# Altium schematic sheet Half_Slave.SchDoc
size B
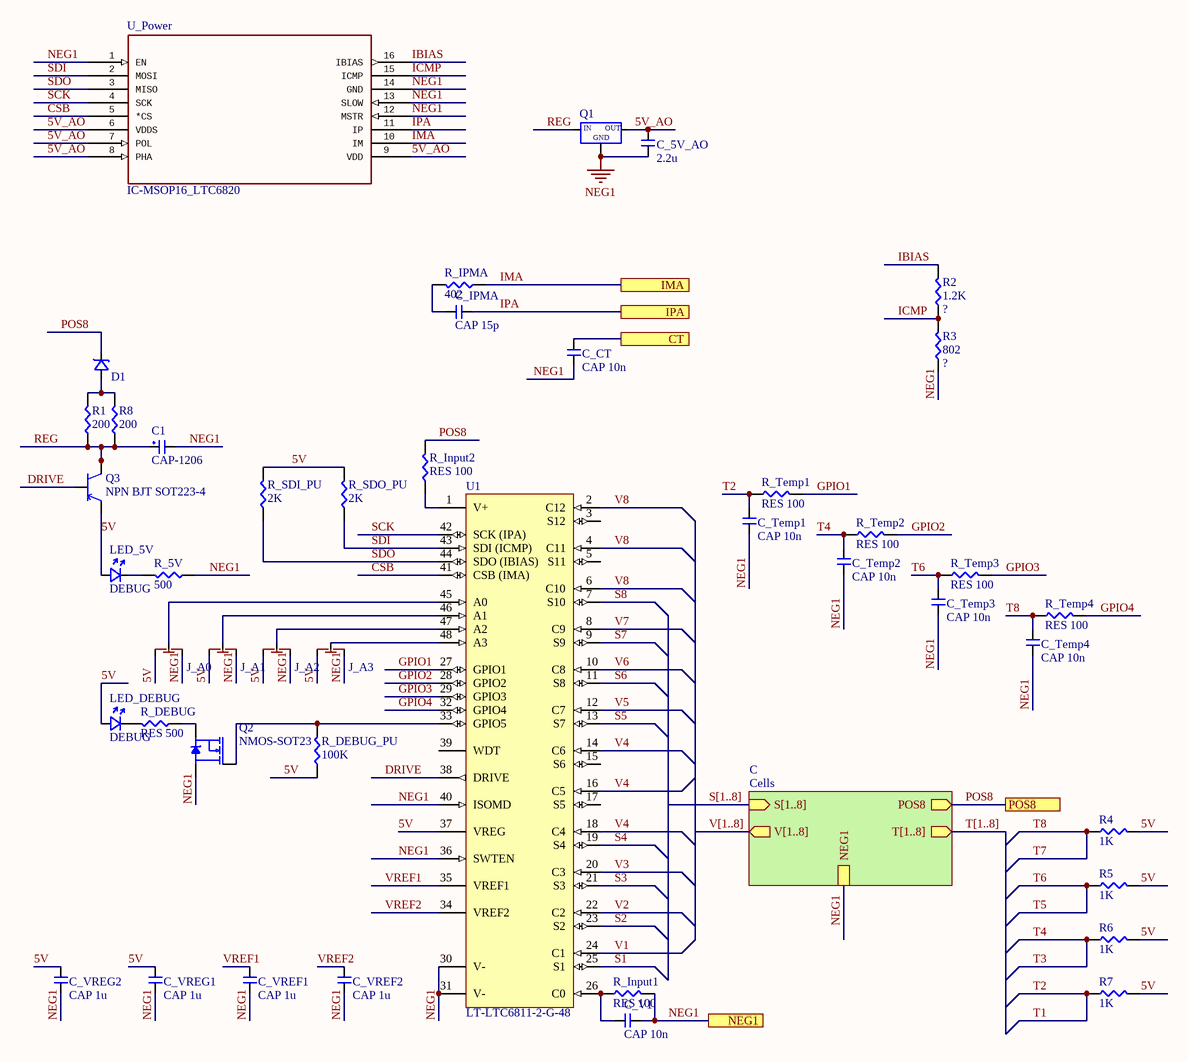
[diagram p0: Half_Slave.SchDoc]

## Parts
C1  CAP-1206  [CAPCP3216X16N]
C_5V_AO  2.2u  [CAP-0603]
C_CT  CAP 10n  [CAP-0603]
C_IPMA  CAP 15p  [CAP-0603]
C_Temp1  CAP 10n  [CAP-0603]
C_Temp2  CAP 10n  [CAP-0603]
C_Temp3  CAP 10n  [CAP-0603]
C_Temp4  CAP 10n  [CAP-0603]
C_V1  CAP 10n  [CAP-0603]
C_VREF1  CAP 1u  [CAP-0603]
C_VREF2  CAP 1u  [CAP-0603]
C_VREG1  CAP 1u  [CAP-0603]
C_VREG2  CAP 1u  [CAP-0603]
D1  ?  [SMB]  (value not drawn)
J_A0  DPDT Solder Jumper  [DPDT Solder]  (value not drawn)
J_A1  DPDT Solder Jumper  [DPDT Solder]  (value not drawn)
J_A2  DPDT Solder Jumper  [DPDT Solder]  (value not drawn)
J_A3  DPDT Solder Jumper  [DPDT Solder]  (value not drawn)
LED_5V  DEBUG  [LED-0603]
LED_DEBUG  DEBUG  [LED-0603]
Q1  5V LDO  [SOT23-5]  (value not drawn)
Q2  NMOS-SOT23  [SOT23]
Q3  NPN BJT SOT223-4  [SOT223]
R1  200  [RES-0603]
R2  1.2K  [RES-0603]
R3  802  [RES-0603]
R4  1K  [RES-0603]
R5  1K  [RES-0603]
R6  1K  [RES-0603]
R7  1K  [RES-0603]
R8  200  [RES-0603]
R_5V  500  [RES-0603]
R_DEBUG  RES 500  [RES-0603]
R_DEBUG_PU  100K  [RES-0603]
R_Input1  RES 100  [RES-0603]
R_Input2  RES 100  [RES-0603]
R_IPMA  402  [RES-0603]
R_SDI_PU  2K  [RES-0603]
R_SDO_PU  2K  [RES-0603]
R_Temp1  RES 100  [RES-0603]
R_Temp2  RES 100  [RES-0603]
R_Temp3  RES 100  [RES-0603]
R_Temp4  RES 100  [RES-0603]
U1  LT-LTC6811-2-G-48  [SSOP-48N]
U_Power  IC-MSOP16_LTC6820  [MSOP16]

## Sub-sheets
C = Cells: S[1..8] (in), POS8 (out), T[1..8] (out), V[1..8] (out), NEG1

## Ports
CT, IMA, IPA, NEG1, POS8

## Nets
NEG1: C1.2 C_5V_AO.2 C_CT.2 C_Temp1.1 C_Temp2.1 C_Temp3.1 C_Temp4.1 C_V1.1 C_VREF1.1 C_VREF2.1 C_VREG1.1 C_VREG2.1 J_A0.1 J_A1.1 J_A2.1 J_A3.1 Q1.2(GND) Q1.3(GND) Q1.4(GND) Q2.2(S) R3.1 R_5V.1 R_Input1.2 U1.30(V-) U1.31(V-) U1.36(SWTEN) U1.40(ISOMD) U_Power.1(EN) U_Power.12(MSTR) U_Power.13(SLOW) U_Power.14(GND) ; port NEG1, sheet C/NEG1
5V: C_VREG1.2 C_VREG2.2 J_A0.2 J_A1.2 J_A2.2 J_A3.2 LED_5V.A LED_DEBUG.A Q3.3(E) R4.2 R5.2 R6.2 R7.2 R_DEBUG_PU.1 R_SDI_PU.2 R_SDO_PU.2 U1.37(VREG)
5V_AO: C_5V_AO.1 Q1.5(OUT) U_Power.6(VDDS) U_Power.7(POL) U_Power.8(PHA) U_Power.9(VDD)
CSB: U1.41(CSB_(IMA)) U_Power.5(*CS)
CT: C_CT.1 ; port CT
DRIVE: Q3.1(B) U1.38(DRIVE)
GPIO1: R_Temp1.2 U1.27(GPIO1)
GPIO2: R_Temp2.2 U1.28(GPIO2)
GPIO3: R_Temp3.2 U1.29(GPIO3)
GPIO4: R_Temp4.2 U1.32(GPIO4)
IBIAS: R2.2 U_Power.16(IBIAS)
ICMP: R2.1 R3.2 U_Power.15(ICMP)
IMA: R_IPMA.1 U_Power.10(IM) ; port IMA
IPA: C_IPMA.1 U_Power.11(IP) ; port IPA
POS8: D1.K R_Input2.2 ; port POS8, sheet C/POS8
REG: C1.1 Q1.1(IN) Q3.2(C) Q3.4(C) R1.1 R8.1
S1: U1.25(S1)
S2: U1.23(S2)
S3: U1.21(S3)
S4: U1.19(S4)
S5: U1.13(S7)
S6: U1.11(S8)
S7: U1.9(S9)
S8: U1.7(S10)
SCK: U1.42(SCK_(IPA)) U_Power.4(SCK)
SDI: R_SDO_PU.1 U1.43(SDI_(ICMP)) U_Power.2(MOSI)
SDO: R_SDI_PU.1 U1.44(SDO_(IBIAS)) U_Power.3(MISO)
T1: C_Temp1.2 R7.1 R_Temp1.1  [also labelled T2]
T3: C_Temp2.2 R6.1 R_Temp2.1  [also labelled T4]
T5: C_Temp3.2 R5.1 R_Temp3.1  [also labelled T6]
T7: C_Temp4.2 R4.1 R_Temp4.1  [also labelled T8]
V1: U1.24(C1)
V2: U1.22(C2)
V3: U1.20(C3)
V4: U1.14(C6) U1.16(C5) U1.18(C4)
V5: U1.12(C7)
V6: U1.10(C8)
V7: U1.8(C9)
V8: U1.2(C12) U1.4(C11) U1.6(C10)
VREF1: C_VREF1.2 U1.35(VREF1)
VREF2: C_VREF2.2 U1.34(VREF2)
NetC_IPMA_2: C_IPMA.2 R_IPMA.2
NetC_V1_2: C_V1.2 R_Input1.1 U1.26(C0)
NetD1_A: D1.A R1.2 R8.2
NetJ_A0_3: J_A0.3 U1.45(A0)
NetJ_A1_3: J_A1.3 U1.46(A1)
NetJ_A2_3: J_A2.3 U1.47(A2)
NetJ_A3_3: J_A3.3 U1.48(A3)
NetLED_5V_K: LED_5V.K R_5V.2
NetLED_DEBUG_K: LED_DEBUG.K R_DEBUG.2
NetQ2_1: Q2.1(G) R_DEBUG_PU.2 U1.33(GPIO5)
NetQ2_3: Q2.3(D) R_DEBUG.1
NetR_Input2_1: R_Input2.1 U1.1(V+)

Not connected (* = marked no-connect by the designer): U1 3(S12) 5(S11) 15(S6) 17(S5) 39(WDT)

## Buses and harness runs
bus S[1..8] = sheet C/S[1..8]
bus T[1..8] = sheet C/T[1..8]
bus V[1..8] = sheet C/V[1..8]

## Library data of the parts
C_5V_AO C_CT C_IPMA C_Temp1-C_Temp4 C_V1 C_VREF1 C_VREF2 C_VREG1 C_VREG2 = CAP-0603
D1 = DIODE-SMB
J_A0-J_A3 = DPDT Solder
LED_5V LED_DEBUG = LED-0603
Q1 = LDO-SOT23-TPS7B69
Q3 = NPN_SOT223-4: BCP54,115
R1 R4-R8 R_5V R_DEBUG R_DEBUG_PU R_Input1 R_Input2 R_IPMA R_SDI_PU R_SDO_PU R_Temp1-R_Temp4 = RES-0603
R2 R3 = RES_0603: RES SMD 0603; Company: IFE; Part: RES_0603; Value: ?; Package: 0603